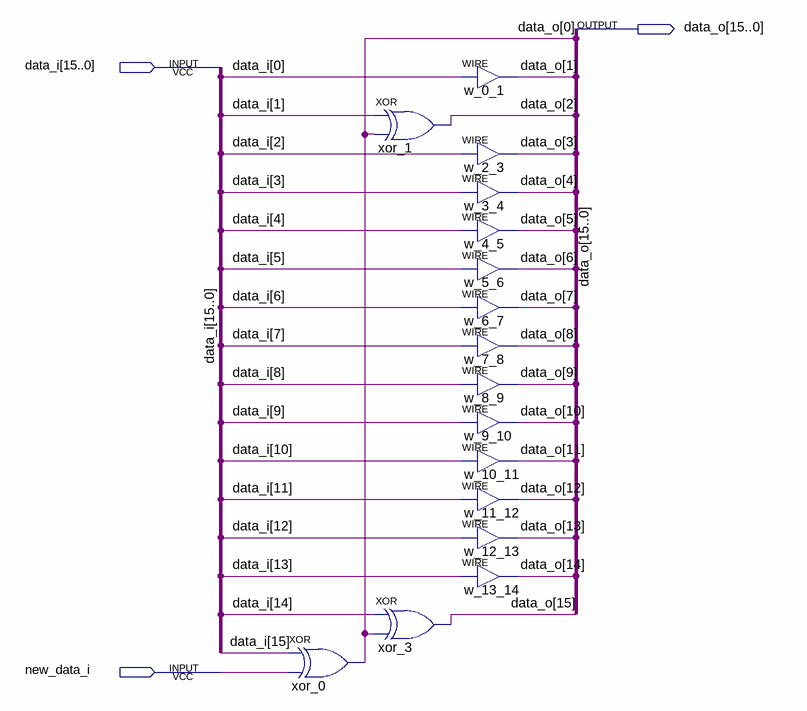
[diagram p0: schematic sheet]
// Quartus schematic algorithm.bdf as structural Verilog: 16 symbols, 3 pins
module algorithm (
  input  [15:0] data_i,
  input  new_data_i,
  output [15:0] data_o
);

  xor xor_0 (data_o[0], data_i[15], new_data_i);
  xor xor_1 (data_o[2], data_i[1], data_o[0]);
  xor xor_3 (data_o[15], data_i[14], data_o[0]);
  assign data_o[1] = data_i[0];  // WIRE w_0_1
  assign data_o[3] = data_i[2];  // WIRE w_2_3
  assign data_o[4] = data_i[3];  // WIRE w_3_4
  assign data_o[5] = data_i[4];  // WIRE w_4_5
  assign data_o[6] = data_i[5];  // WIRE w_5_6
  assign data_o[7] = data_i[6];  // WIRE w_6_7
  assign data_o[8] = data_i[7];  // WIRE w_7_8
  assign data_o[9] = data_i[8];  // WIRE w_8_9
  assign data_o[10] = data_i[9];  // WIRE w_9_10
  assign data_o[11] = data_i[10];  // WIRE w_10_11
  assign data_o[12] = data_i[11];  // WIRE w_11_12
  assign data_o[13] = data_i[12];  // WIRE w_12_13
  assign data_o[14] = data_i[13];  // WIRE w_13_14
endmodule
